# Altium schematic sheet NearBreakout.SchDoc
size A4; SheetNumber: 1; SheetTotal: 1
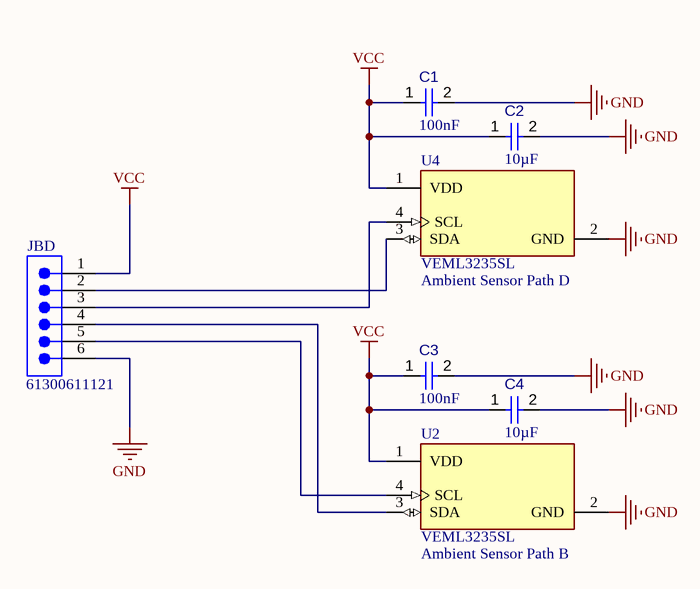
[diagram p0: NearBreakout.SchDoc]

## Parts
C1  value 100nF  [FP-0805-L_2_01_0_2-W_1_25-IPC_B]  (hidden comment: 08051C104K4T2A)
C2  value 10µF  [CAPC0805(2012)145_L]  (hidden comment: Capacitor 10µF +/-20% 25V 0805)
C3  value 100nF  [FP-0805-L_2_01_0_2-W_1_25-IPC_B]  (hidden comment: 08051C104K4T2A)
C4  value 10µF  [CAPC0805(2012)145_L]  (hidden comment: Capacitor 10µF +/-20% 25V 0805)
JBD  61300611121  [61300611121]
U2  VEML3235SL  [FP-VEML3235SL-MFG]
U4  VEML3235SL  [FP-VEML3235SL-MFG]

## Nets
GND: C1.2 C2.2 C3.2 C4.2 JBD.6 U2.2(GND) U4.2(GND)
VCC: C1.1 C2.1 C3.1 C4.1 JBD.1 U2.1(VDD) U4.1(VDD)
NetJBD_2: JBD.2 U4.3(SDA)
NetJBD_3: JBD.3 U4.4(SCL)
NetJBD_4: JBD.4 U2.3(SDA)
NetJBD_5: JBD.5 U2.4(SCL)

## Notes on the sheet
- (near U4) Ambient Sensor Path D
- (near U2) Ambient Sensor Path B

## Library data of the parts
C1 C3 = CMP-001-00084-1: Ceramic Capacitor, Multilayer, Ceramic, 100V, 10% +Tol, 10% -Tol, X7R, 15% TC, 0.1uF, Surface Mount, 0805; Max Operating Temperature: 125°C; Mounting Technology: Surface Mount; RoHS Compliant: Yes; Capacitor Type: Ceramic; Pins: 2; Case/Package: 0805; Min Operating Temperature: -55°C
C2 C4 = CMP-001-00079-4: Chip Capacitor, 10µF +/-20%, 25V, 0805, Thickness 1.45 mm; Tolerance: 10%; Max Operating Temperature: 85°C; Case/Package: 0805; Voltage Rating: 25V; Min Operating Temperature: -55°C; Mounting Technology: SMT; Pins: 2
JBD = CMP-002-00086-1: Board Connector, 6 Contact(s), 1 Row(s), Male, Straight, 0.1 inch Pitch, Solder Terminal, Locking, Black Insulator, Plug; Max Operating Temperature: 125°C; Connector Type: BOARD CONNECTOR; Min Operating Temperature: -40°C; Mounting Technology: Board; RoHS Compliant: Yes
U2 U4 = CMP-02530-000008-1: AMBIENT LIGHT SENSOR, IC, SIDE L